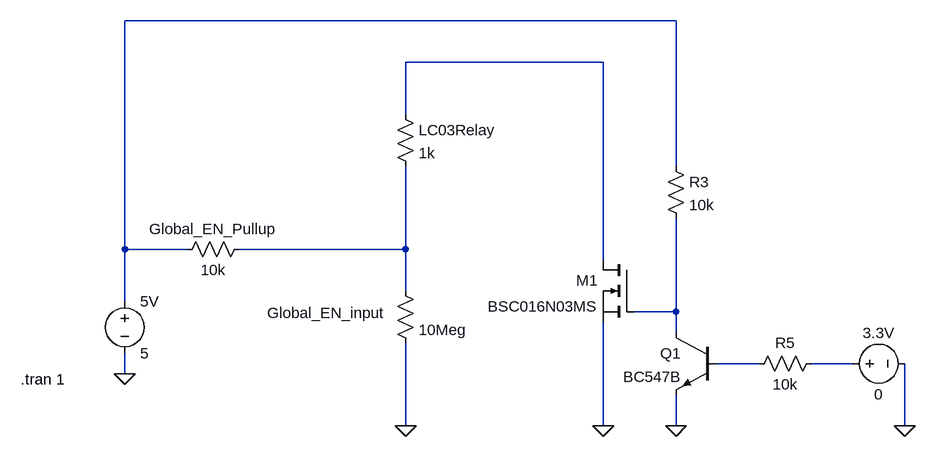
[diagram p0: schematic PowerOffCircuit.asc]
PowerOffCircuit.asc, the LTspice schematic file:
Version 4
SHEET 1 1604 680
WIRE 1120 -128 272 -128
WIRE 1008 -64 704 -64
WIRE 704 16 704 -64
WIRE 1120 96 1120 -128
WIRE 272 224 272 -128
WIRE 368 224 272 224
WIRE 704 224 704 96
WIRE 704 224 448 224
WIRE 1008 240 1008 -64
WIRE 704 288 704 224
WIRE 272 304 272 224
WIRE 1120 320 1120 176
WIRE 1120 320 1056 320
WIRE 1120 352 1120 320
WIRE 1248 400 1184 400
WIRE 1392 400 1328 400
WIRE 272 416 272 384
WIRE 704 496 704 368
WIRE 1008 496 1008 336
WIRE 1120 496 1120 448
WIRE 1472 496 1472 400
FLAG 272 416 0
FLAG 704 496 0
FLAG 1008 496 0
FLAG 1472 496 0
FLAG 1120 496 0
SYMBOL voltage 272 288 R0
WINDOW 123 0 0 Left 0
WINDOW 39 0 0 Left 0
SYMATTR InstName 5V
SYMATTR Value 5
SYMBOL res 464 208 R90
WINDOW 0 0 56 VBottom 2
WINDOW 3 32 56 VTop 2
SYMATTR InstName Global_EN_Pullup
SYMATTR Value 10k
SYMBOL res 688 272 R0
WINDOW 0 -197 50 Left 2
SYMATTR InstName Global_EN_input
SYMATTR Value 10Meg
SYMBOL res 688 0 R0
SYMATTR InstName LC03Relay
SYMATTR Value 1k
SYMBOL nmos 1056 240 M0
SYMATTR InstName M1
SYMATTR Value BSC016N03MS
SYMBOL res 1104 80 R0
SYMATTR InstName R3
SYMATTR Value 10k
SYMBOL npn 1184 352 M0
SYMATTR InstName Q1
SYMATTR Value BC547B
SYMBOL voltage 1376 400 R270
WINDOW 0 32 56 VTop 2
WINDOW 3 -32 56 VBottom 2
SYMATTR InstName 3.3V
SYMATTR Value 0
SYMBOL res 1344 384 R90
WINDOW 0 0 56 VBottom 2
WINDOW 3 32 56 VTop 2
SYMATTR InstName R5
SYMATTR Value 10k
TEXT 112 424 Left 2 !.tran 1

The netlist it stands for:
* PowerOffCircuit.asc
V§5V N001 0 5
R§Global_EN_Pullup N003 N001 10k
R§Global_EN_input N003 0 10Meg
R§LC03Relay N002 N003 1k
M1 N002 N004 0 0 BSC016N03MS
R3 N001 N004 10k
Q1 N004 N005 0 0 BC547B
V§3.3V N006 0 0
R5 N006 N005 10k
.model NPN NPN
.model PNP PNP
.lib standard.bjt
.model NMOS NMOS
.model PMOS PMOS
.lib standard.mos
.tran 1
.backanno
.end